# EAGLE design sensorBox (EAGLE 7.6.0)
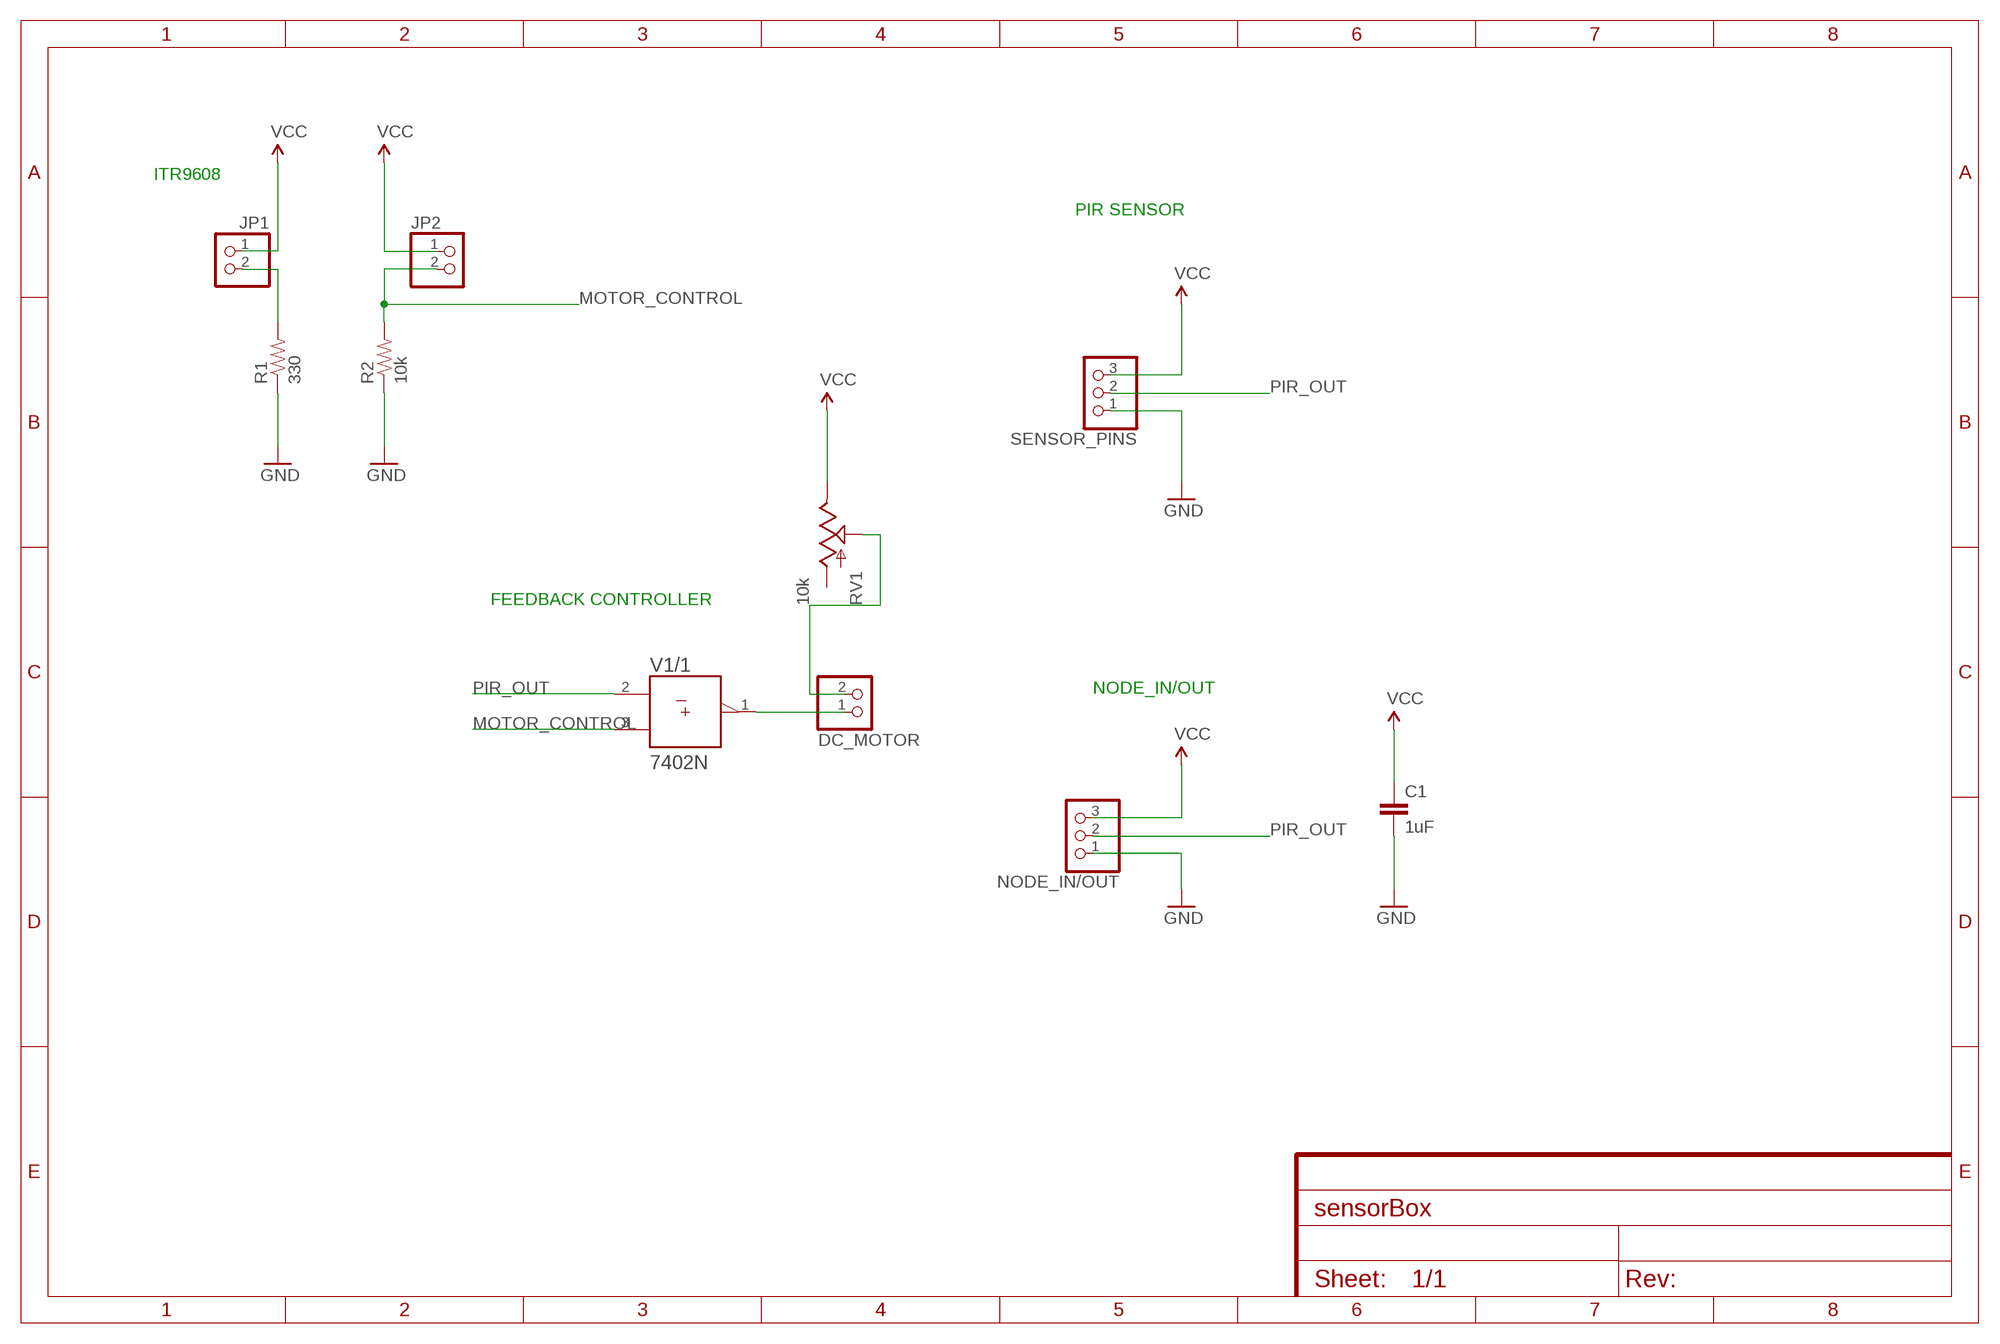
[diagram p0: schematic, sheet 1]

## Parts
C1  1uF  CAPPTH  [CAP-PTH-SMALL]
DC_MOTOR  PINHD-1X2  [1X02]
JP1  PINHD-1X2  [1X02]
JP2  PINHD-1X2  [1X02]
NODE_IN/OUT  PINHD-1X3  [1X03]
R1  330  RESISTORPTH-1/4W  [AXIAL-0.4]
R2  10k  RESISTORPTH-1/4W  [AXIAL-0.4]
RV1  10k  POTTRIM  [TRIM_POT]
SENSOR_PINS  PINHD-1X3  [1X03]
V1  7402N  [DIL14]

## Nets
GND: C1.2 NODE_IN/OUT.1 R1.P$1 R2.P$1 SENSOR_PINS.1
MOTOR_CONTROL: JP2.2 R2.P$2 V1.3(/1:B)
N$1: JP1.2 R1.P$2
N$2: DC_MOTOR.2 RV1.1(S)
N$3: DC_MOTOR.1 V1.1(/1:Y)
PIR_OUT: NODE_IN/OUT.2 SENSOR_PINS.2 V1.2(/1:A)
VCC: C1.1 JP1.1 JP2.1 NODE_IN/OUT.3 RV1.2(E) SENSOR_PINS.3
Unconnected: RV1.3(A) V1.4(/2:Y) V1.5(/2:A) V1.6(/2:B) V1.8(/3:A) V1.9(/3:B) V1.10(/3:Y) V1.11(/4:A) V1.12(/4:B) V1.13(/4:Y)

## Notes on the sheet
- ITR9608
- PIR SENSOR
- FEEDBACK CONTROLLER
- NODE_IN/OUT

## Power pins joined to a net without a drawn wire
+UB: V1.14(/+UB:+UB)
-UB: V1.7(/-UB:-UB)

## Library data of the parts
C1 = SparkFun-Passives:CAP: Capacitor Standard 0603 ceramic capacitor, and 0.1" leaded capacitor.
DC_MOTOR JP1 JP2 = pinhead:PINHD-1X2: PIN HEADER
NODE_IN/OUT SENSOR_PINS = pinhead:PINHD-1X3: PIN HEADER
R1 R2 = SparkFun-Passives:RESISTOR: Resistor Basic schematic elements and footprints for 0603, 1206, and PTH resistors.
RV1 = SparkFun-Electromechanical:POT
V1 = 74ttl-din:74*02: Quad 2-input NOR gate

## Board
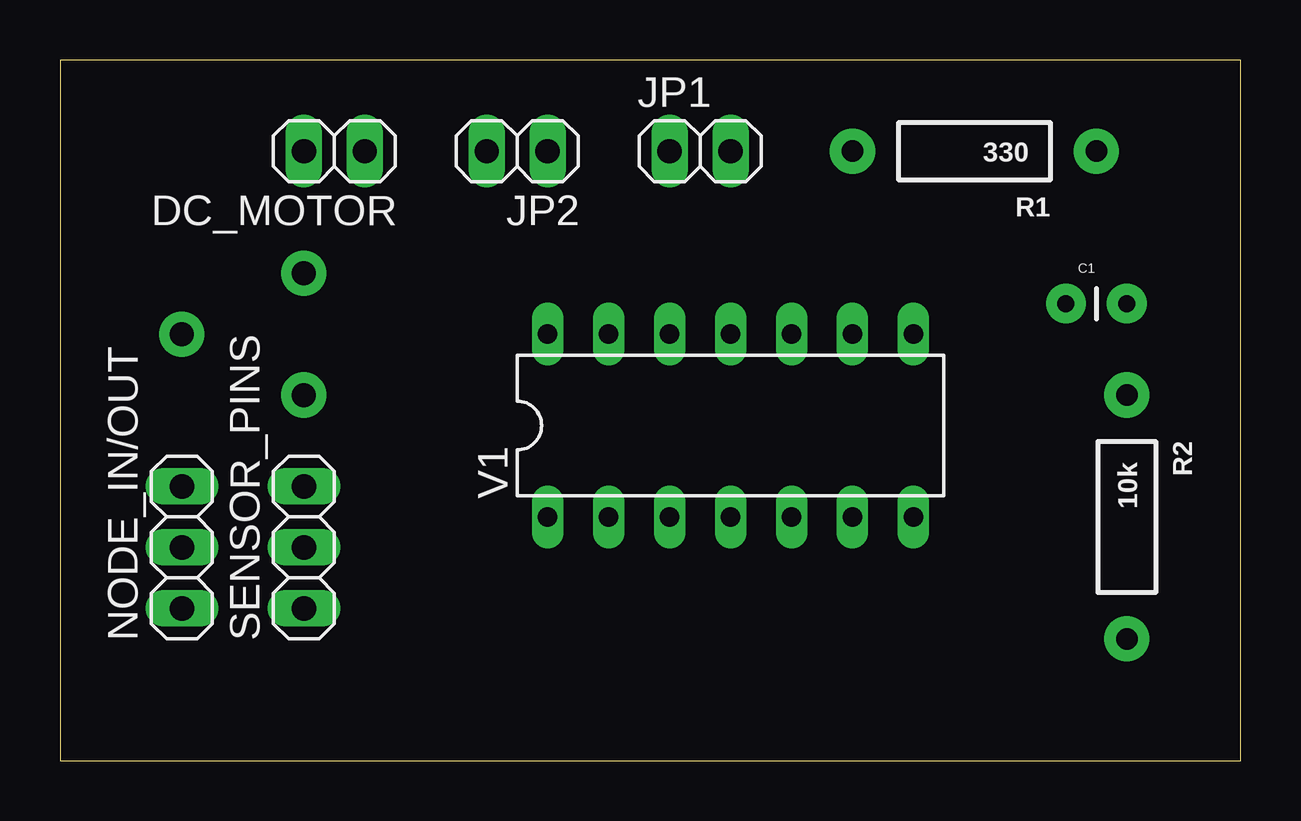
[diagram p1: board, top side]
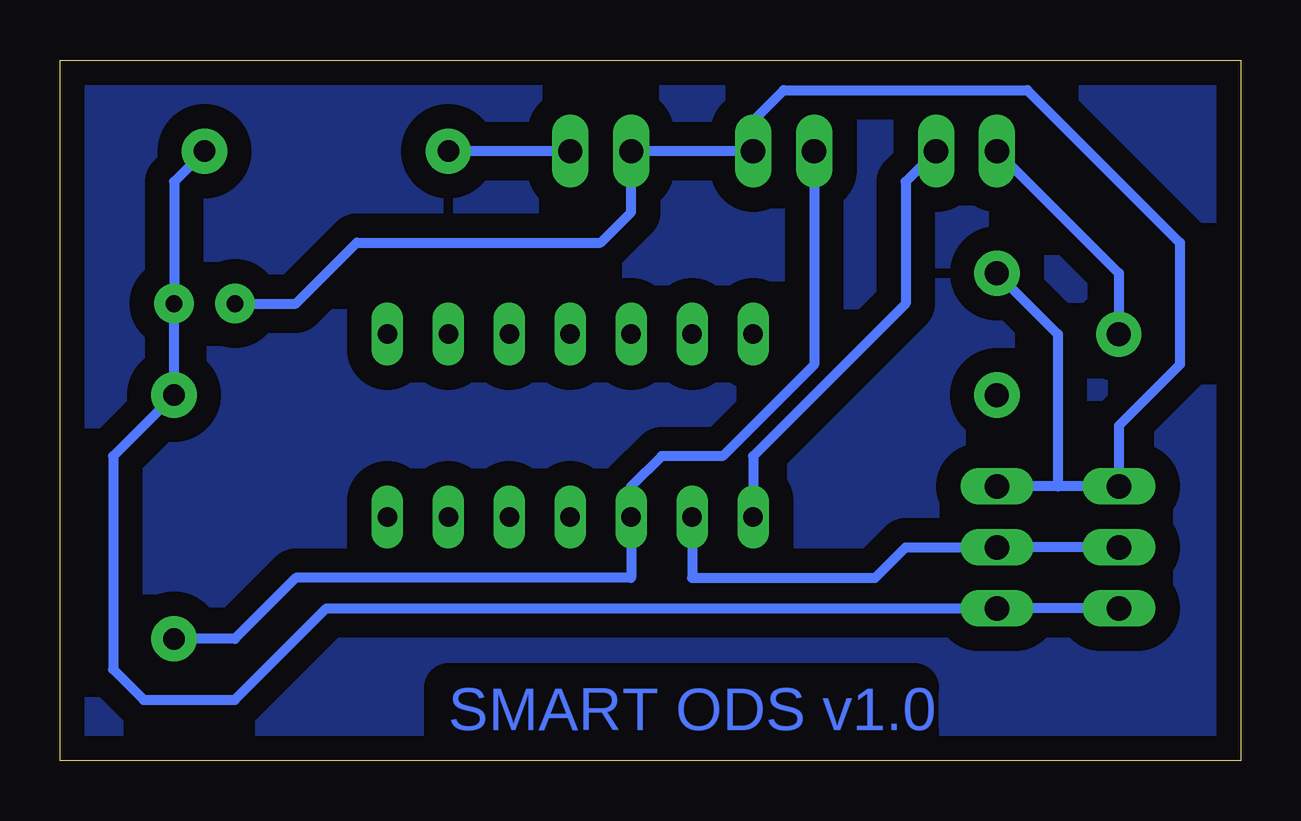
[diagram p2: board, bottom side, seen from below]

Size 49.2 x 29.2 mm. Coordinates in mm from the lower left corner, seen from the top.
Outline: 0,0 49.2,0 49.2,29.2 0,29.2 0,0
Copper layers (1*16): Top 0.035mm / dielectric 1.5mm / Bottom 0.035mm
Design rules "default": minimum track width 10mil, minimum drill 24mil, track to track 8mil, track to pad 8mil, pad to pad 8mil, via to via 8mil, smd to smd 8mil, copper to edge 40mil, drill to drill 8mil, minimum pad ring 10mil, minimum via ring 8mil, stop-mask expansion 4mil, vias tented up to drill 0mil, thermal gap 10mil

### Footprints (pad centres in the part's own frame; a part is rotated, then mirrored left to right if it is on the bottom)
CAP-PTH-SMALL = drill 0.7 pad 1.651: 1 0,0; 2 2.54,0
1X02 = drill 1.016 long: 1 -1.27,0; 2 1.27,0
1X03 = drill 1.016 long: 1 -2.54,0; 2 0,0; 3 2.54,0
AXIAL-0.4 = drill 0.9 pad 1.88: P$1 -5.08,0; P$2 5.08,0
TRIM_POT = drill 1 pad 1.88: 1 5.08,0; 2 0,2.54; 3 0,-2.54
DIL14 = drill 0.813 long: 1 -7.62,-3.81; 2 -5.08,-3.81; 3 -2.54,-3.81; 4 0,-3.81; 5 2.54,-3.81; 6 5.08,-3.81; 7 7.62,-3.81; 8 7.62,3.81; 9 5.08,3.81; 10 2.54,3.81; 11 0,3.81; 12 -2.54,3.81; 13 -5.08,3.81; 14 -7.62,3.81

### Placement (x,y rotation side)
C1  41.91,19.05 0 top
DC_MOTOR  11.43,25.4 180 top
JP1  26.67,25.4 0 top
JP2  19.05,25.4 180 top
NODE_IN/OUT  5.08,8.89 90 top
R1  38.1,25.4 180 top
R2  44.45,10.16 270 top
RV1  10.16,17.78 0 bottom
SENSOR_PINS  10.16,8.89 90 top
V1  27.94,13.97 0 top

### Tracks (layer width: path | path; a pad name or v marks a point on that pad's centre or on a via)
GND
  Bottom 0.406: NODE_IN/OUT.1 SENSOR_PINS.1 38.1,6.35 41.91,2.54 45.72,2.54 46.99,3.81 46.99,12.7 R2.P$1 C1.2 44.45,24.13 R1.P$1
MOTOR_CONTROL
  Bottom 0.406: R2.P$2 41.91,5.08 39.37,7.62 25.4,7.62 V1.3 25.4,11.43 24.13,12.7 21.59,12.7 17.78,16.51 JP2.2
N$1
  Bottom 0.406: JP1.2 R1.P$2
N$2
  Bottom 0.406: DC_MOTOR.2 5.08,20.32 RV1.1
N$3
  Bottom 0.406: DC_MOTOR.1 13.97,24.13 13.97,19.05 20.32,12.7 V1.1
N$4
  pour Bottom (isolate 1.016): 0,29.21 49.53,29.21 49.53,0 0,0
PIR_OUT
  Bottom 0.406: NODE_IN/OUT.2 SENSOR_PINS.2 13.97,8.89 15.24,7.62 22.86,7.62 V1.2
VCC
  Bottom 0.406: 7.62,11.43 NODE_IN/OUT.3 5.08,13.97 2.54,16.51 2.54,21.59 8.89,27.94 19.05,27.94 20.32,26.67 JP2.1 JP1.1 25.4,22.86 26.67,21.59 36.83,21.59 39.37,19.05 C1.1 | 7.62,11.43 SENSOR_PINS.3 | RV1.2 7.62,17.78 7.62,11.43

### Text on the board
Bottom: SMART ODS v1.0